# EAGLE design Sample and Hold Main (EAGLE 9.6.2)
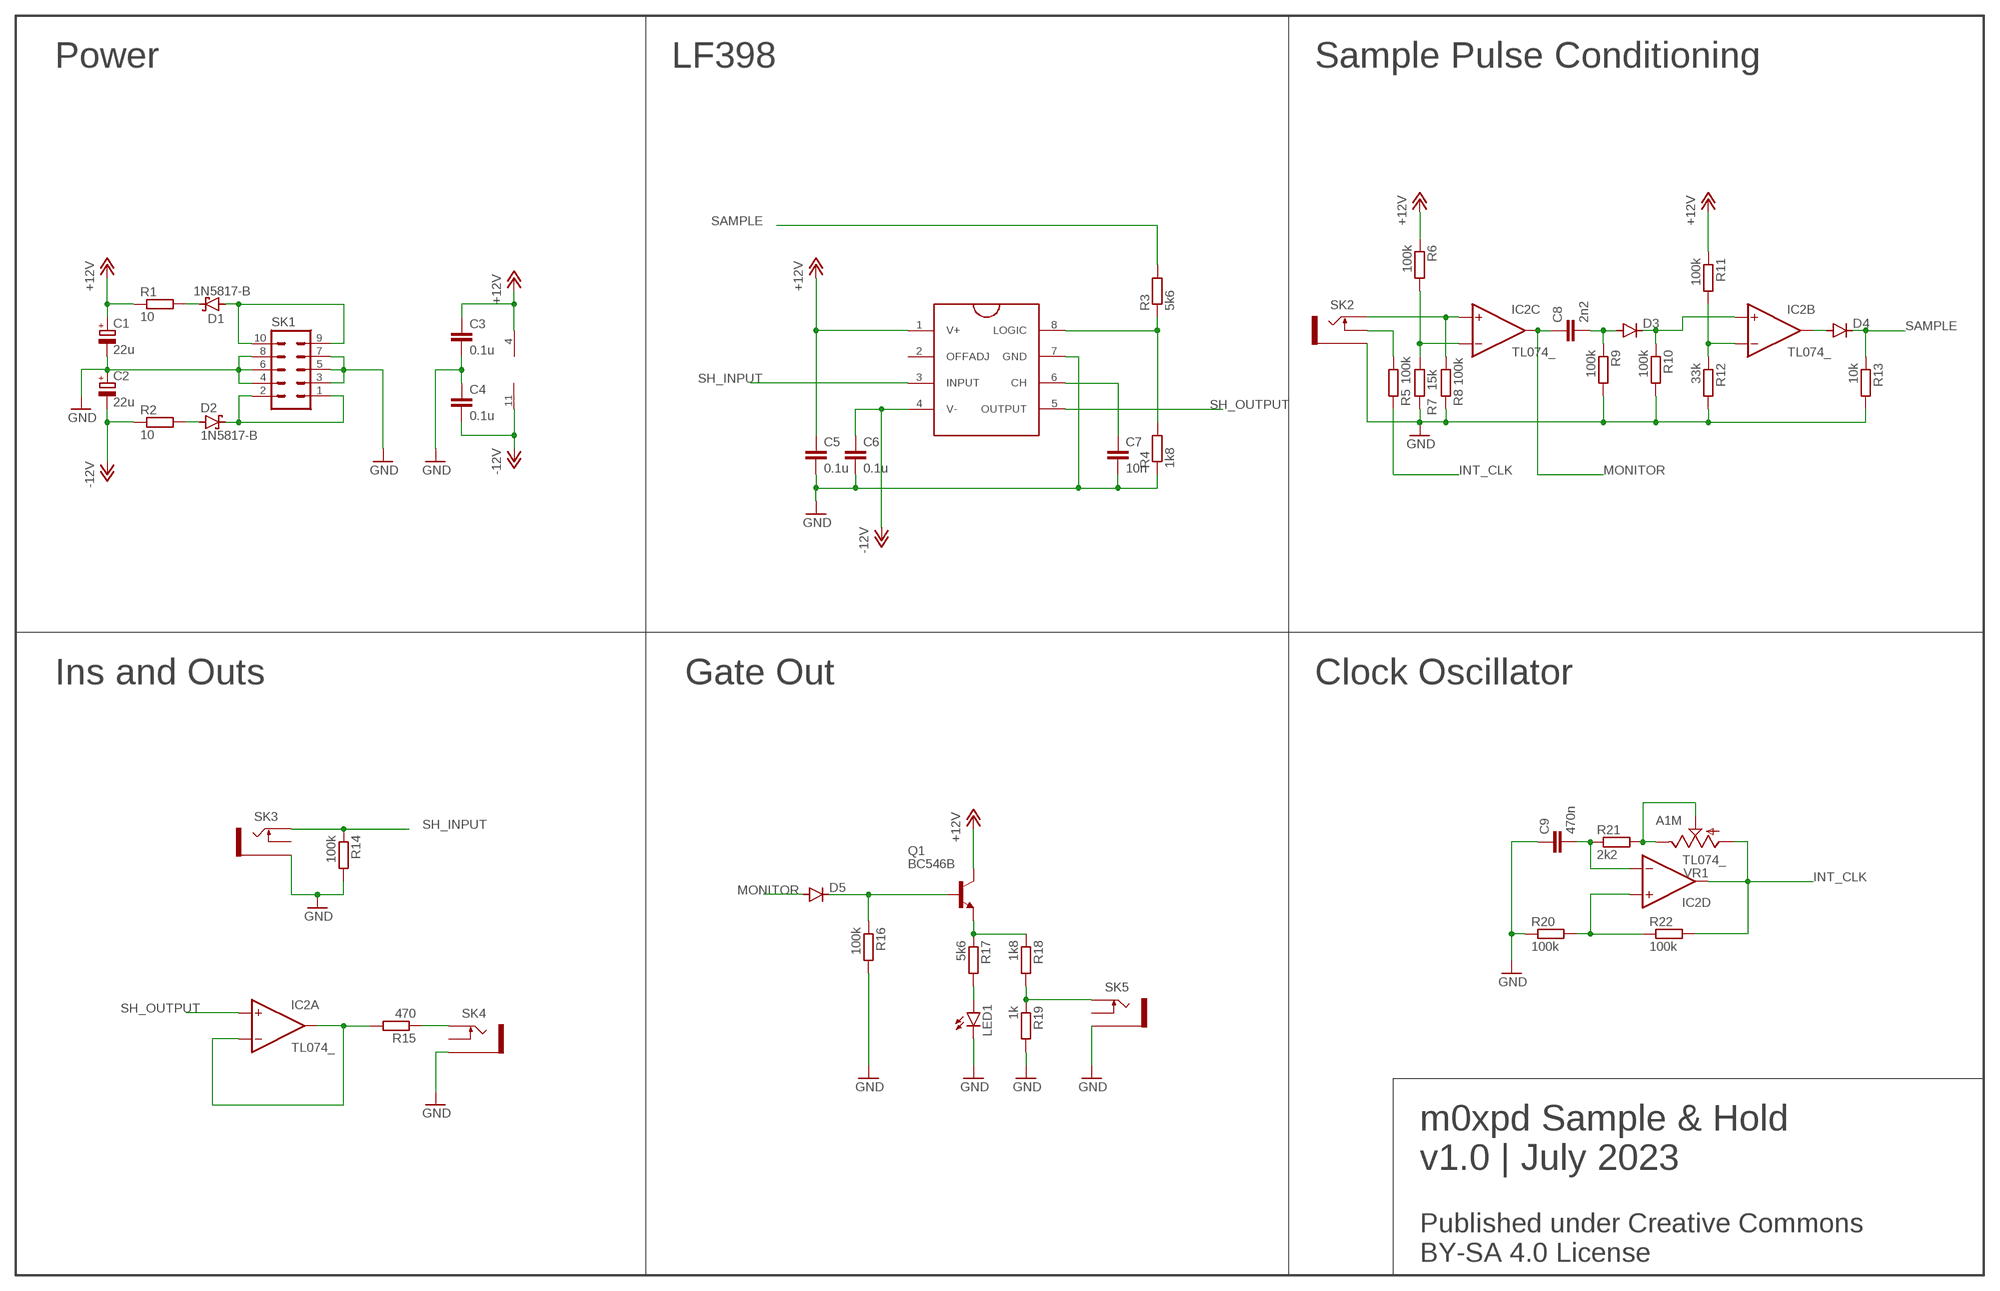
[diagram p0: schematic, sheet 1]

## Parts
C1  22u  CPOL-EUE2.5-6  [E2,5-6]
C2  22u  CPOL-EUE2.5-6  [E2,5-6]
C3  0.1u  C-EU050-024X044  [C050-024X044]
C4  0.1u  C-EU050-024X044  [C050-024X044]
C5  0.1u  C-EU050-024X044  [C050-024X044]
C6  0.1u  C-EU050-024X044  [C050-024X044]
C7  10n  C-EU050-025X075  [C050-025X075]
C8  2n2  C-EU050-024X044  [C050-024X044]
C9  470n  C-EU050-035X075  [C050-035X075]
D1  1N5817-B  [DO41-7.6]
D2  1N5817-B  [DO41-7.6]
D3  1N4148DO35-7  [DO35-7]
D4  1N4148DO35-7  [DO35-7]
D5  1N4148DO35-7  [DO35-7]
IC1  LF398  [DIL08]
IC2  TL074_  [DIL14]
LED1  LED3MM  [LED3MM]
Q1  BC546B  [TO92-EBC]
R1  10  R-EU_0204/7  [0204/7]
R2  10  R-EU_0204/7  [0204/7]
R3  5k6  R-EU_0204/7  [0204/7]
R4  1k8  R-EU_0204/7  [0204/7]
R5  100k  R-EU_0204/7  [0204/7]
R6  100k  R-EU_0204/7  [0204/7]
R7  15k  R-EU_0204/7  [0204/7]
R8  100k  R-EU_0204/7  [0204/7]
R9  100k  R-EU_0204/7  [0204/7]
R10  100k  R-EU_0204/7  [0204/7]
R11  100k  R-EU_0204/7  [0204/7]
R12  33k  R-EU_0204/7  [0204/7]
R13  10k  R-EU_0204/7  [0204/7]
R14  100k  R-EU_0204/7  [0204/7]
R15  470  R-EU_0204/7  [0204/7]
R16  100k  R-EU_0204/7  [0204/7]
R17  5k6  R-EU_0204/7  [0204/7]
R18  1k8  R-EU_0204/7  [0204/7]
R19  1k  R-EU_0204/7  [0204/7]
R20  100k  R-EU_0204/7  [0204/7]
R21  2k2  R-EU_0204/7  [0204/7]
R22  100k  R-EU_0204/7  [0204/7]
SK1  EURO_POWER_HEADERFAT_PADS  [EURO_PWR_HEADER_FAT]
SK2  THONKICONNNEW  [WQP-PJ301M-12_JACK]
SK3  THONKICONNNEW  [WQP-PJ301M-12_JACK]
SK4  THONKICONNNEW  [WQP-PJ301M-12_JACK]
SK5  THONKICONNNEW  [WQP-PJ301M-12_JACK]
VR1  A1M  9MM_SNAP-IN_POT_  [9MM_SNAP-IN_POT]

## Nets
+12V: C1.+ C3.1 C5.1 IC1.1(V+) IC2.4(P:V+) Q1.C R1.1 R6.1 R11.1
-12V: C2.- C4.2 C6.1 IC1.4(V-) IC2.11(P:V-) R2.1
GND: C1.- C2.+ C3.2 C4.1 C5.2 C6.2 C7.2 C9.1 IC1.7(GND) LED1.K(C) R4.1 R7.2 R8.2 R9.2 R10.2 R12.2 R13.2 R14.2 R16.2 R19.2 R20.1 SK1.3 SK1.4 SK1.5 SK1.6 SK1.7 SK1.8 SK2.P$3_SLEEVE(SLEEVE) SK3.P$3_SLEEVE(SLEEVE) SK4.P$3_SLEEVE(SLEEVE) SK5.P$3_SLEEVE(SLEEVE)
INT_CLK: IC2.14(D:OUT) R5.2 R22.2 VR1.1(A)
MONITOR: C8.1 D5.A IC2.8(C:OUT)
N$1: IC2.1(A:OUT) IC2.2(A:-IN) R15.2
N$2: IC2.9(C:-IN) R6.2 R7.1
N$3: R15.1 SK4.P$1_TIP(TIP)
N$4: C7.1 IC1.6(CH)
N$5: IC2.10(C:+IN) R8.1 SK2.P$1_TIP(TIP)
N$6: IC1.8(LOGIC) R3.1 R4.2
N$7: Q1.E R17.1 R18.1
N$8: C8.2 D3.A R9.1
N$9: D3.C IC2.5(B:+IN) R10.1
N$10: LED1.A R17.2
N$11: IC2.6(B:-IN) R11.2 R12.1
N$12: D4.A IC2.7(B:OUT)
N$14: C9.2 IC2.13(D:-IN) R21.1
N$15: IC2.12(D:+IN) R20.2 R22.1
N$16: D5.C Q1.B R16.1
N$17: R21.2 VR1.2(S) VR1.3(E)
N$18: R5.1 SK2.P$2_SWITCH(SWITCH)
N$19: R18.2 R19.1 SK5.P$1_TIP(TIP)
N$20: D2.C SK1.1 SK1.2
N$21: D1.A SK1.9 SK1.10
N$22: D1.C R1.2
N$23: D2.A R2.2
SAMPLE: D4.C R3.2 R13.1
SH_INPUT: IC1.3(INPUT) R14.1 SK3.P$1_TIP(TIP)
SH_OUTPUT: IC1.5(OUTPUT) IC2.3(A:+IN)
Unconnected: IC1.2(OFFADJ) SK3.P$2_SWITCH(SWITCH) SK4.P$2_SWITCH(SWITCH) SK5.P$2_SWITCH(SWITCH)

## Notes on the sheet
- Power | LF398 | Sample Pulse Conditioning
- Ins and Outs | Gate Out | Clock Oscillator
- m0xpd Sample & Hold
- v1.0 | July 2023
- Published under Creative Commons 
  BY-SA 4.0 License

## Library data of the parts
C1 C2 = rcl:CPOL-EU: POLARIZED CAPACITOR, European symbol; SPICEPREFIX: C
C3-C9 = rcl:C-EU: CAPACITOR, European symbol; SPICEPREFIX: C
D1 D2 = diode:1N581*: 1.0A SCHOTTKY BARRIER RECTIFIER Source: http://www.diodes.com/datasheets/ds23001.pdf
D3-D5 = diode:1N4148: DIODE high speed (Philips)
IC1 = MyLibrary:LF398: Sample and Hold device
IC2 = MusicThingModular:TL074: Generic Quad Op Amp
LED1 = led:LED: LED OSRAM: - CHIPLED LG R971, LG N971, LY N971, LG Q971, LY Q971, LO R971, LY R971 LH N974, LH R974 LS Q976, LO Q976, LY Q976 LO Q996 - Hyper CHIPLED LW Q18S LB Q993, LB Q99A, LB R99A - SideLED LS A670, LO A670, LY A670, LG A670, LP A670 LB A673, LV A673, LT A673, LW A673 LH A674 LY A675 LS A676, LA A676, LO A676, LY A676, LW A676 LS A679, LY A679, LG A679 - Hyper Micro SIDELED® LS Y876, LA Y876, LO Y876, LY Y876 LT Y87S - SmartLED LW L88C, LW L88S LB L89C, LB L89S, LG L890 LS L89K, LO L89K, LY L89K LS L896, LA L896, LO L896, LY L896 - TOPLED LS T670, LO T670, LY T670, LG T670, LP T670 LSG T670, LSP T670, LSY T670, LOP T670, LYG T670 LG T671, LOG T671, LSG T671 LB T673, LV T673, LT T673, LW T673 LH T674 LS T676, LA T676, LO T676, LY T676, LB T676, LH T676, LSB T676, LW T676 LB T67C, LV T67C, LT T67C, LS T67K, LO T67K, LY T67K, LW E67C LS E67B, LA E67B, LO E67B, LY E67B, LB E67C, LV E67C, LT E67C LW T67C LS T679, LY T679, LG T679 LS T770, LO T770, LY T770, LG T770, LP T770 LB T773, LV T773, LT T773, LW T773 LH T774 LS E675, LA E675, LY E675, LS T675 LS T776, LA T776, LO T776, LY T776, LB T776 LHGB T686 LT T68C, LB T68C - Hyper Mini TOPLED® LB M676 - Mini TOPLED Santana® LG M470 LS M47K, LO M47K, LY M47K Source: http://www.osram.convergy.de LUXEON: - LUMILED® LXK2-PW12-R00, LXK2-PW12-S00, LXK2-PW14-U00, LXK2-PW14-V00 LXK2-PM12-R00, LXK2-PM12-S00, LXK2-PM14-U00 LXK2-PE12-Q00, LXK2-PE12-R00, LXK2-PE12-S00, LXK2-PE14-T00, LXK2-PE14-U00 LXK2-PB12-K00, LXK2-PB12-L00, LXK2-PB12-M00, LXK2-PB14-N00, LXK2-PB14-P00, LXK2-PB14-Q00 LXK2-PR12-L00, LXK2-PR12-M00, LXK2-PR14-Q00, LXK2-PR14-R00 LXK2-PD12-Q00, LXK2-PD12-R00, LXK2-PD12-S00 LXK2-PH12-R00, LXK2-PH12-S00 LXK2-PL12-P00, LXK2-PL12-Q00, LXK2-PL12-R00 Source: www.luxeon.com KINGBRIGHT: KA-3528ASYC Source: www.kingbright.com
Q1 = transistor-npn:BC546*: NPN Transistor
R1-R22 = rcl:R-EU_: RESISTOR, European symbol; SPICEPREFIX: R
SK1 = MusicThingModular:EURO_POWER_HEADER: Power Header 10 pin power header for Eurorack Power Supplies Variants with fatter pads for easier soldering, and the LOCK variant which has 5mil offset pins to hold the component in place before soldering
SK2-SK5 = MusicThingModular:THONKICONN: 3.5mm socket for Eurorack modular synths
VR1 = MusicThingModular:9MM_SNAP-IN_POT: 9mm vertical snap-in pot, Alpha / Panasonic style

## Board
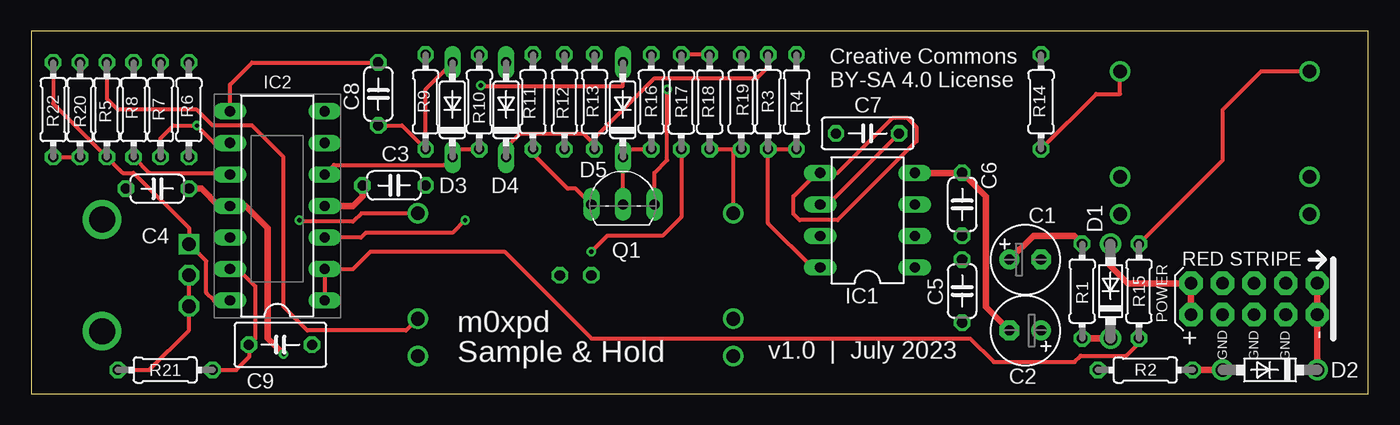
[diagram p1: board, top side]
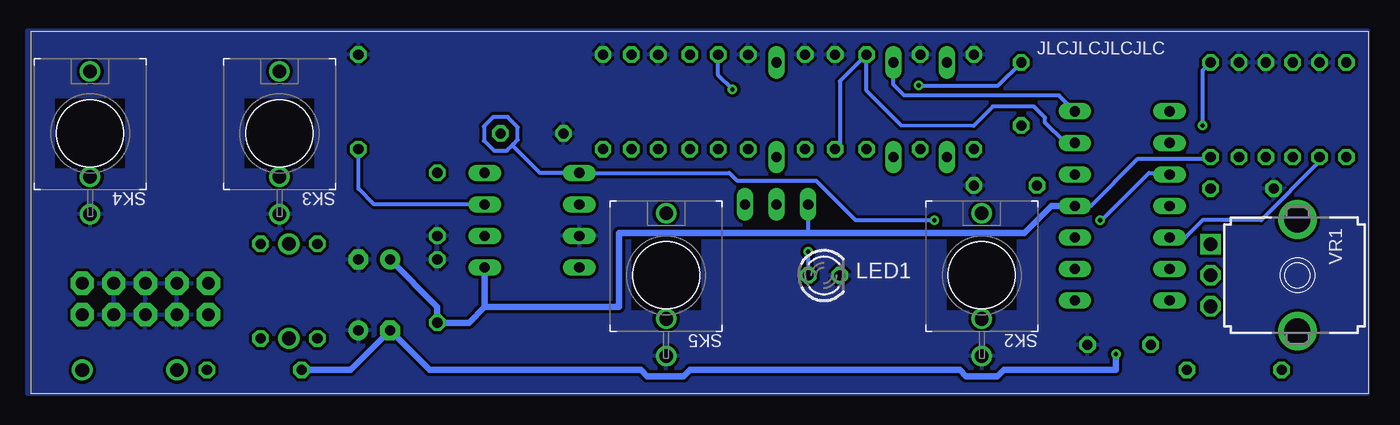
[diagram p2: board, bottom side, seen from below]

Size 107.62 x 29.2 mm. Coordinates in mm from the lower left corner, seen from the top.
Outline: 0,0 107.62,0 107.62,29.2 0,29.2 0,0
Copper layers (1*16): Top 0.035mm / dielectric 1.5mm / Bottom 0.035mm
Design rules "default *": minimum track width 6mil, minimum drill 0.35mm, track to track 10mil, track to pad 10mil, pad to pad 6mil, via to via 6mil, smd to smd 6mil, copper to edge 0mil, drill to drill 6mil, minimum pad ring 10mil, minimum via ring 8mil, stop-mask expansion 4mil, vias tented up to drill 0mil, thermal gap 10mil

### Footprints (pad centres in the part's own frame; a part is rotated, then mirrored left to right if it is on the bottom)
E2,5-6 = drill 0.813 pad 1.6: + -1.27,0 | drill 0.813 pad 1.6 octagon: - 1.27,0
C050-024X044 = drill 0.813 octagon: 1 -2.54,0; 2 2.54,0
C050-025X075 = drill 0.813 octagon: 1 -2.54,0; 2 2.54,0
C050-035X075 = drill 0.813 octagon: 1 -2.54,0; 2 2.54,0
DO41-7.6 = drill 1.1 pad 1.7: A 3.81,0; C -3.81,0
DO35-7 = drill 0.813 long: A 3.81,0; C -3.81,0
DIL08 = drill 0.813 pad 1.27 long: 1 -3.81,-3.81; 2 -1.27,-3.81; 3 1.27,-3.81; 4 3.81,-3.81; 5 3.81,3.81; 6 1.27,3.81; 7 -1.27,3.81; 8 -3.81,3.81
DIL14 = drill 0.813 long: 1 -7.62,-3.81; 2 -5.08,-3.81; 3 -2.54,-3.81; 4 0,-3.81; 5 2.54,-3.81; 6 5.08,-3.81; 7 7.62,-3.81; 8 7.62,3.81; 9 5.08,3.81; 10 2.54,3.81; 11 0,3.81; 12 -2.54,3.81; 13 -5.08,3.81; 14 -7.62,3.81
LED3MM = drill 0.813 octagon: A -1.27,0; K 1.27,0
TO92-EBC = drill 0.813 long: B 0,-1.27; C -2.54,-1.27; E 2.54,-1.27
0204/7 = drill 0.813 octagon: 1 -3.81,0; 2 3.81,0
EURO_PWR_HEADER_FAT = drill 1.016 pad 1.88 octagon: 1 -5.08,-1.27; 2 -5.08,1.27; 3 -2.54,-1.27; 4 -2.54,1.27; 5 0,-1.27; 6 0,1.27; 7 2.54,-1.27; 8 2.54,1.27; 9 5.08,-1.27; 10 5.08,1.27
WQP-PJ301M-12_JACK = drill 1.1: P$1_TIP 0,5; P$2_SWITCH 0,-3.5; P$3_SLEEVE 0,-6.5
9MM_SNAP-IN_POT = drill 1.1 square: 1 -2.5,-7 | drill 1.1 octagon: 2 0,-7; 3 2.5,-7 | drill 2.1 pad 2.794: CHASSIS1 -4.5,0; CHASSIS2 4.5,0

### Placement (x,y rotation side)
C1  80.01,10.79 0 top
C2  80.01,5.08 180 top
C3  29.21,16.76 0 top
C4  10.16,16.51 0 top
C5  74.93,8.26 90 top
C6  74.93,15.24 270 top
C7  67.31,20.95 180 top
C8  27.94,24.13 270 top
C9  20.07,3.94 180 top
D1  86.87,8.26 90 top
D2  99.69,1.91 180 top
D3  33.91,22.86 90 top
D4  38.23,22.86 90 top
D5  47.62,22.86 90 top
IC1  67.31,13.97 90 top
IC2  19.81,15.11 90 top
LED1  43.81,9.53 0 bottom
Q1  47.62,16.51 0 top
R1  84.58,8.26 270 top
R2  89.66,1.91 0 top
R3  59.31,23.5 90 top
R4  61.59,23.5 270 top
R5  6.1,22.86 270 top
R6  12.7,22.86 90 top
R7  10.41,22.86 90 top
R8  8.26,22.86 90 top
R9  31.75,23.5 90 top
R10  36.07,23.5 90 top
R11  40.39,23.5 90 top
R12  42.93,23.5 90 top
R13  45.34,23.5 90 top
R14  81.28,23.5 90 top
R15  89.15,8.26 270 top
R16  49.91,23.5 90 top
R17  52.32,23.5 270 top
R18  54.61,23.5 270 top
R19  57.15,23.5 90 top
R20  3.94,22.86 270 top
R21  10.79,1.91 180 top
R22  1.78,22.86 90 top
SK1  98.42,7.62 180 top
SK2  31.11,9.53 0 bottom
SK3  87.63,20.95 0 bottom
SK4  102.87,20.95 0 bottom
SK5  56.52,9.53 0 bottom
VR1  5.71,9.53 270 bottom

### Tracks (layer width: path | path; a pad name or v marks a point on that pad's centre or on a via)
+12V
  Top 0.305: Q1.C 43.81,16.51 43.18,16.51 40.39,19.3 R11.1
  Top 0.508: R1.1 83.95,12.7 80.64,12.7 C1.+ | IC2.4 25.91,15.11 26.67,15.88 C3.1
  Bottom 0.305: IC2.4 22.35,15.11 18.54,18.92 12.83,18.92 R6.1 | Q1.C 45.09,12.95
  Bottom 0.508: 71.12,6.99 72.39,5.71 C5.1 74.93,6.99 C1.+ | IC1.1 71.12,6.99 | IC2.4 25.53,15.11 27.69,12.95 45.09,12.95 60.33,12.95 60.33,6.99 71.12,6.99
-12V  (via drill 0.35)
  Top 0.508: IC1.4 C6.1 76.83,15.88 76.83,6.99 C2.- | v20.32,3.17 19.05,4.45 19.05,13.34 17.27,15.11 IC2.11 15.11,15.11 13.72,16.51 C4.2
  Bottom 0.508: R2.1 81.92,1.91 C2.- 75.56,1.91 58.55,1.91 58.04,1.4 55.12,1.4 54.61,1.91 32.89,1.91 32.38,1.4 29.84,1.4 29.34,1.91 20.32,1.91 v20.32,3.17
GND
  pour Bottom: 0,0 0,29.21 107.95,29.21 107.95,0
INT_CLK
  Top 0.305: R22.2 1.78,23.37 R5.2 7.37,17.78 8.26,17.78 12.71,13.32 12.71,12.06 | 12.71,12.06 VR1.1 | 12.71,12.06 14.1,10.68 14.1,8.13 14.73,7.49 IC2.14
MONITOR  (via drill 0.35)
  Top 0.305: IC2.8 16,24.89 17.78,26.67 C8.1 | v36.2,24.81 36.24,24.77 47.62,24.77 D5.A
  Bottom 0.305: C8.1 29.84,24.77 36.2,24.77 v36.2,24.81
N$1
  Top 0.305: IC2.1 IC2.2 25.91,10.03 27.3,11.43 38.1,11.43 45.09,4.45 75.56,4.45 77.47,2.54 83.96,2.54 84.47,3.05 88.14,3.05 89.15,4.06 R15.2
N$2  (via drill 0.35)
  Top 0.305: IC2.9 14.73,20.19 v13.34,21.59 11.43,21.59 10.41,20.57 R7.1
  Bottom 0.305: R6.2 13.34,26.04 v13.34,21.59
N$3
  Top 0.305: R15.1 95.89,18.8 95.89,22.86 98.98,25.95 SK4.P$1_TIP
N$4
  Top 0.305: IC1.6 64.14,15.24 C7.1
N$5  (via drill 0.35)
  Top 0.305: R8.1 9.53,17.78 15.88,17.78 IC2.10 | SK2.P$1_TIP 26.59,14.53 25.91,13.84 21.72,13.84 v21.59,13.97
  Bottom 0.305: v21.59,13.97 21.46,13.97 17.65,17.78 16.13,17.78 IC2.10
N$6
  Top 0.305: R3.1 59.56,19.68 | 59.56,19.68 R4.2 | IC1.8 62.87,10.16 59.31,13.72 59.31,19.43 59.56,19.68
N$7  (via drill 0.35)
  Top 0.305: R18.1 R17.1 | Q1.E 50.16,17.78 51.18,18.8 v51.18,24.51
  Bottom 0.305: R17.1 52.32,25.65 v51.18,24.51
N$8
  Top 0.305: C8.2 29.84,21.59 R9.1 31.75,24.51 D3.A
N$9
  Top 0.305: R10.1 34.54,19.68 34.1,19.24 D3.C 33.27,18.41 24.38,18.41 IC2.5
N$10  (via drill 0.35)
  Top 0.305: R17.2 52.32,14.22 50.8,12.7 46.35,12.7 v45.09,11.43
  Bottom 0.305: v45.09,11.43 LED1.A
N$11
  Bottom 0.305: IC2.6 23.75,20.32 24.51,20.32 26.04,21.84 26.04,22.23 26.92,23.11 30.23,23.11 31.79,21.55 37.59,21.59 40.39,24.38 R11.2 42.55,25.15 42.55,20.07 R12.1
N$12
  Bottom 0.305: IC2.7 24.89,24 37.34,24 38.23,24.89 D4.A
N$14
  Top 0.305: IC2.13 16.64,10.03 18.03,8.64 18.03,4.45 17.59,4 | 17.59,4 C9.2 | R21.1 16.51,1.91 17.59,2.98 17.59,4
N$15
  Top 0.305: R22.1 R20.2
  Bottom 0.305: R20.2 3.94,18.67 8.64,13.97 13.34,13.97 14.73,12.57 IC2.12
N$16
  Top 0.305: R16.1 48.26,19.68 D5.C Q1.B
N$17
  Top 0.305: R21.2 9.53,1.91 12.71,5.09 VR1.3 VR1.2
N$18
  Top 0.305: SK2.P$2_SWITCH 30.17,5.08 22.23,5.08 20.32,6.99 20.32,19.05 17.78,21.59 14.61,21.59 13.34,22.86 6.99,22.86 6.1,23.75 R5.1
N$19
  Top 0.305: R18.2 56.52,19.68 | 56.52,19.68 R19.1 | SK5.P$1_TIP 56.52,19.68
N$20
  Top 0.508: SK1.1 SK1.2 D2.C
N$21
  Top 0.508: SK1.10 SK1.9 88.27,8.89 86.87,10.29 D1.A
N$22
  Top 0.508: D1.C R1.2
N$23
  Top 0.508: D2.A R2.2
SAMPLE
  Top 0.305: D4.C 38.23,19.81 39.37,20.95 44.45,20.95 45.34,20.07 R13.1 45.34,20.57 50.16,25.4 58.42,25.4 59.31,26.29 R3.2
SH_INPUT
  Top 0.305: R14.1 85.72,24.13 87.63,24.13 SK3.P$1_TIP
  Bottom 0.305: R14.1 81.28,16.51 80.01,15.24 IC1.3
SH_OUTPUT  (via drill 0.35)
  Top 0.305: v34.92,13.97 33.91,12.95 26.92,12.95 26.54,12.57 IC2.3 | IC1.5 64.9,17.78 69.34,22.23 70.48,22.23 71.25,21.46 71.25,20.32 64.9,13.97 61.85,13.97 61.34,14.48 61.34,15.88 63.25,17.78 IC1.5
  Bottom 0.305: v34.92,13.97 41.27,13.97 44.45,17.14 50.8,17.14 51.44,17.78 IC1.5 66.67,17.78 68.83,19.94 68.83,20.07 | 68.83,20.07 68.45,20.45 68.45,21.46 69.27,22.28 70.43,22.28 71.17,21.54 71.17,20.37 70.36,19.56 69.34,19.56 68.83,20.07

### Text on the board
tNames: Creative Commons / BY-SA 4.0 License | m0xpd | Sample & Hold | v1.0 | July 2023
bNames: JLCJLCJLCJLC